# EasyEDA schematic SCH_Arduboi_2023-01-19.json
TITLE: Sheet_1; REV: 1.0; Date: 2023-01-18; Sheet: 1/1; Company: Your Company
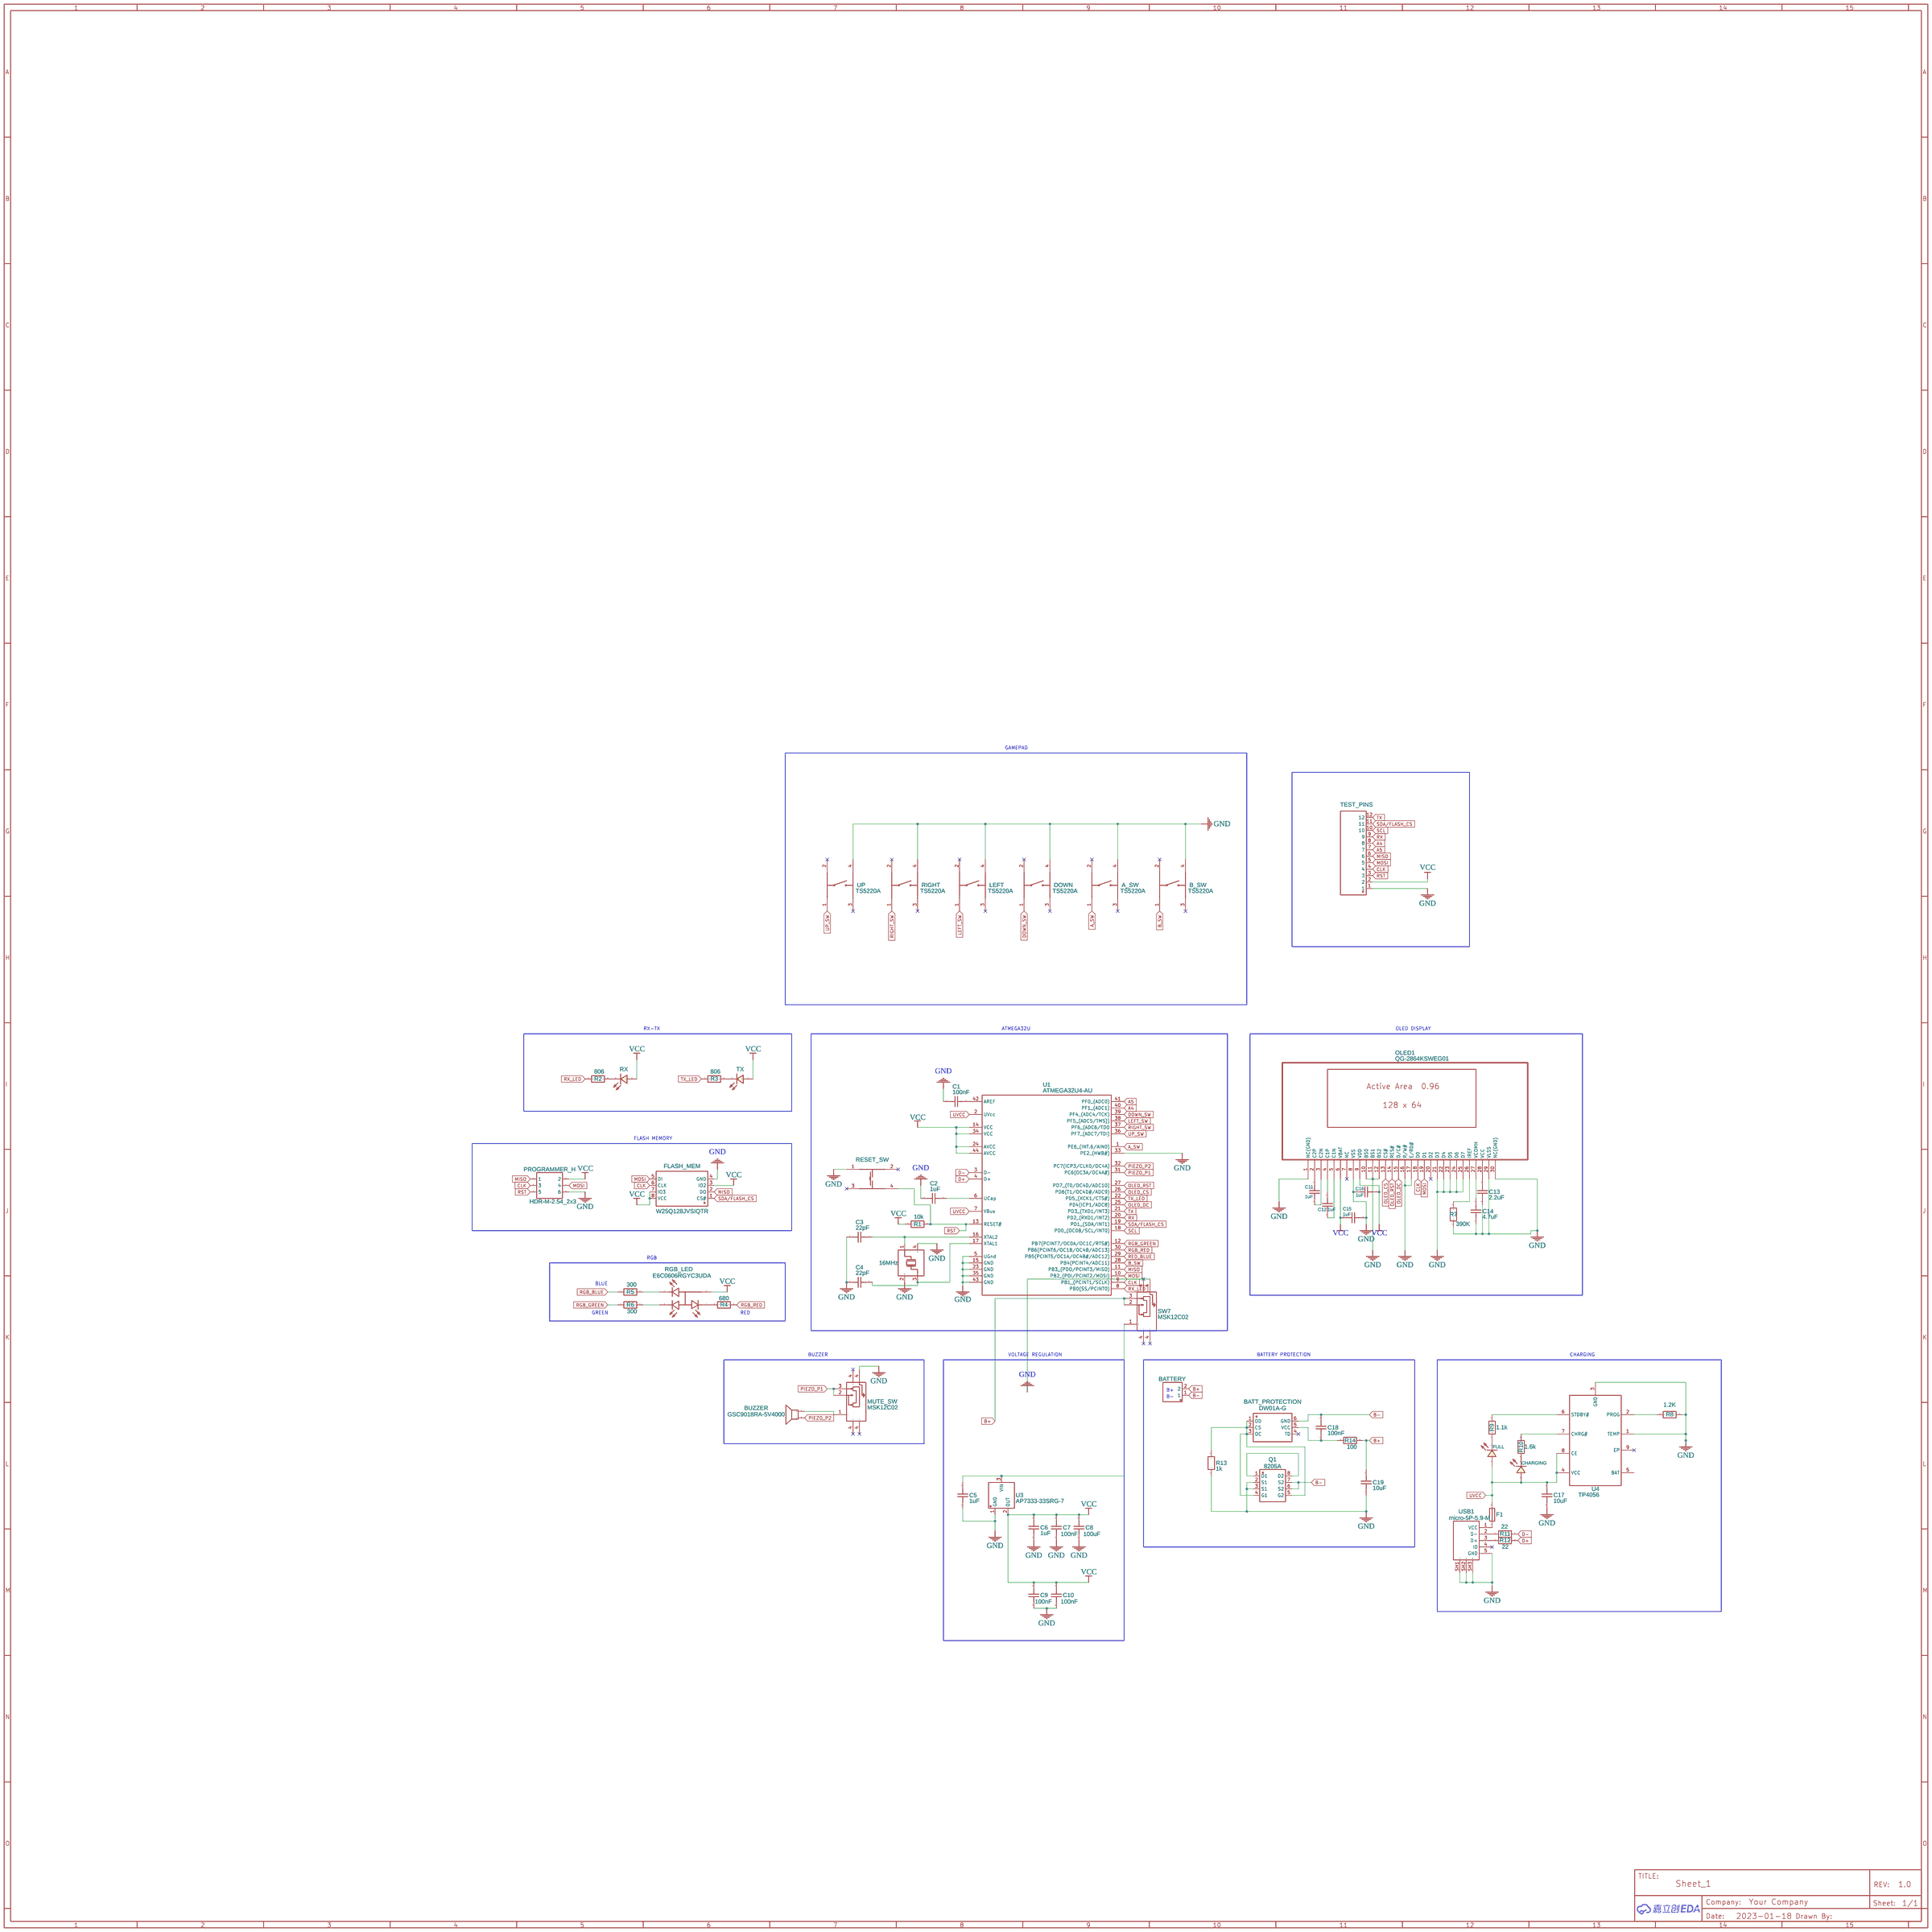
[diagram p0: schematic sheet]

## Parts
A_SW  TS5220A  [SW-SMD_4P-L5.2-W5.2-P3.70-LS6.4]
B_SW  TS5220A  [SW-SMD_4P-L5.2-W5.2-P3.70-LS6.4]
BATT_PROTECTION  DW01A-G  [SOT-23-6_L2.9-W1.6-P0.95-LS2.8-BR]
BATTERY  MTP125-1102S1  [HDR-TH_2P-P2.54-V-M-1]
BUZZER  GSC9018RA-5V4000  [BUZ-SMD_L9.0-W9.0-P8.00-LS9.3]
C1  100nF  [C0603]
C2  1uF  [C0603]
C3  22pF  [C0603]
C4  22pF  [C0603]
C5  1uF  [C0603]
C6  1uF  [C0603]
C7  100nF  [C0603]
C8  100uF  [C0603]
C9  100nF  [C0603]
C10  100nF  [C0603]
C11  1uF  [C0603]
C12  1uF  [C0603]
C13  2.2uF  [C0603]
C14  4.7uF  [C0603]
C15  1uF  [C0603]
C16  1uF  [C0603]
C17  10uF  [C0603]
C18  100nF  [C0603]
C19  10uF  [C0603]
CHARGING  LED-0603_R  [LED0603_RED]
DOWN  TS5220A  [SW-SMD_4P-L5.2-W5.2-P3.70-LS6.4]
F1  0805L110SLYR  [F0805]
FLASH_MEM  W25Q128JVSIQTR  [SOIC-8_L5.3-W5.3-P1.27-LS8.0-BL]
FULL  LED-0603_G  [LED0603_GREEN]
LEFT  TS5220A  [SW-SMD_4P-L5.2-W5.2-P3.70-LS6.4]
MUTE_SW  MSK12C02  [SW-TH_MSK12C02]
OLED1  QG-2864KSWEG01  [OLED-SMD_QG-2864KSWEG01]
PROGRAMMER_H  HDR-M-2.54_2x3  [HDR-M-2.54_2X3]
Q1  8205A  [TSSOP-8_L4.4-W3.0-P0.65-LS6.4-BL]
R1  10k  [R0603]
R2  806  [R0603]
R3  806  [R0603]
R4  680  [R0603]
R5  300  [R0603]
R6  300  [R0603]
R7  390K  [R0603]
R8  1.2K  [R0603]
R9  1.1k  [R0603]
R10  1.6k  [R0603]
R11  22  [R0603]
R12  22  [R0603]
R13  1k  [R0603]
R14  100  [R0603]
RESET_SW  K2-1808UN-A4SW-04  [KEY-SMD_4P-L4.2-W3.2-P2.20-LS4.6]
RGB_LED  E6C0606RGYC3UDA  [LED-SMD_4P-L1.6-W1.6-TL-FD]
RIGHT  TS5220A  [SW-SMD_4P-L5.2-W5.2-P3.70-LS6.4]
RX  LED-0603_B  [LED0603_BLUE]
SW7  MSK12C02  [SW-TH_MSK12C02]
TEST_PINS  A2541WR-12P  [HDR-TH_12P-P2.54-H-M-W8.6]
TX  LED-0603_B  [LED0603_BLUE]
U1  ATMEGA32U4-AU  [QFP-44_L10.0-W10.0-P0.80-LS13.2-BL]
U2  16MHz  [CRYSTAL-SMD_4P-L2.5-W2.0-BL-2]
U3  AP7333-33SRG-7  [SOT-23-3_L2.9-W1.3-P1.90-LS2.4-BR]
U4  TP4056  [ESOP-8_L4.9-W3.9-P1.27-LS6.0-BL-EP]
UP  TS5220A  [SW-SMD_4P-L5.2-W5.2-P3.70-LS6.4]
USB1  micro-5P-5.9-M  [MICRO-USB-SMD_MICRO-5P-5.9]

## Library data of the parts
A_SW B_SW DOWN LEFT RIGHT UP = TS5220A: Supplier: LCSC; Supplier Part: C412370; Manufacturer: SHOU HAN(首韩); Contributor: LCSC; JLCPCB Part Class: Extended Part
BATT_PROTECTION = DW01A-G: Supplier: LCSC; Manufacturer: FORTUNE(富晶); Contributor: LCSC; Supplier Part: C61503; JLCPCB Part Class: Extended Part
BATTERY = MTP125-1102S1: Supplier: LCSC; Supplier Part: C358684; Manufacturer: MINTRON(明硕); Contributor: LCSC; JLCPCB Part Class: Extended Part
BUZZER = GSC9018RA-5V4000: Supplier: LCSC; Supplier Part: C255319; Manufacturer: INGHAi(赢海); Contributor: LCSC; JLCPCB Part Class: Extended Part; Frequency: 4000Hz
C1-C19 = C_0603_US: Contributor: LCEDA_Lib
CHARGING = LED-0603_R: Manufacturer: EVERLIGHT(台湾亿光); Manufacturer Part: 19-217/R6C-AL1M2VY/3T; Supplier Part: C72044; Supplier: LCSC; Contributor: LCEDA_01
F1 = 0805L110SLYR: Supplier: LCSC; Supplier Part: C207024; Manufacturer: Littelfuse(美国力特); Contributor: LCSC; JLCPCB Part Class: Extended Part
FLASH_MEM = W25Q128JVSIQTR: Supplier: LCSC; Manufacturer: WINBOND(华邦); Manufacturer Part: W25Q128JVSIQ; Supplier Part: C97521; JLCPCB Part Class: Basic Part
FULL = LED-0603_G: Manufacturer: EVERLIGHT(台湾亿光); Manufacturer Part: 19-217/GHC-YR1S2/3T; Supplier Part: C72043; Supplier: LCSC; Contributor: LCEDA_Lib
MUTE_SW SW7 = MSK12C02: Supplier: LCSC; Supplier Part: C431540; Manufacturer: SHOU HAN(首韩); Contributor: LCSC; JLCPCB Part Class: Extended Part
OLED1 = QG-2864KSWEG01: Supplier: LCSC; Manufacturer: Allvision(全智景); Supplier Part: C85007
PROGRAMMER_H = HDR-M-2.54_2x3: Supplier Part: C65114; Supplier: LCSC; Contributor: LCEDA_Lib
Q1 = 8205A: Supplier: LCSC; Manufacturer: Hottech(合科泰); Contributor: LCSC; Supplier Part: C181100; JLCPCB Part Class: Extended Part
R1-R14 = R_0603_EU: Contributor: LCEDA_Lib
RESET_SW = K2-1808UN-A4SW-04: Supplier: LCSC; Manufacturer: 韩国韩荣; Contributor: LCSC; Supplier Part: C145878; JLCPCB Part Class: Extended Part
RGB_LED = E6C0606RGYC3UDA: Supplier: LCSC; Supplier Part: C5162234; Manufacturer: null; Contributor: lcsc; JLCPCB Part Class: Extended Part
RX TX = LED-0603_B: Manufacturer: EVERLIGHT(台湾亿光); Manufacturer Part: 19-217/BHC-ZL1M2RY/3T; Supplier Part: C72041; Supplier: LCSC; Contributor: LCEDA_01
TEST_PINS = A2541WR-12P: Supplier: LCSC; Supplier Part: C225498; Manufacturer: Changjiang Connectors; Contributor: LCSC; JLCPCB Part Class: Extended Part
U1 = ATMEGA32U4-AU: Supplier: LCSC; Manufacturer: MICROCHIP(美国微芯); Supplier Part: C44854; JLCPCB Part Class: Extended Part
U2 = NX2520SA-16MHZ-STD-CSW-4: Supplier: LCSC; Supplier Part: C1985890; Manufacturer: NDK; Contributor: lcsc; JLCPCB Part Class: Extended Part
U3 = AP7333-33SRG-7: Supplier: LCSC; Manufacturer: DIODES(美台); Contributor: LCSC; Supplier Part: C150745; JLCPCB Part Class: Extended Part
U4 = TP4056: Contributor: Guest; Supplier: LCSC; Manufacturer: TOPPOWER(南京拓微); Manufacturer Part: TP4056-42-ESOP8; Supplier Part: C16581; JLCPCB Part Class: Basic Part
USB1 = micro-5P-5.9-M: Supplier: LCSC; Manufacturer: 精拓金; Manufacturer Part: 920-C62A2021S10100; Supplier Part: C40939; JLCPCB Part Class: Extended Part

## Nets
GND: A_SW.4 B_SW.4 C1.1 C2.1 C3.1 C4.1 C5.1 C6.1 C7.1 C8.1 C9.1 C10.1 C13.1 C14.1 C15.2 C16.1 C17.1 C19.1 DOWN.4 FLASH_MEM.4(GND) LEFT.4 MUTE_SW.4 OLED1.1(NC(GND)) OLED1.8(VSS) OLED1.10(BS0) OLED1.11(BS1) OLED1.12(BS2) OLED1.16(R/W#) OLED1.17(E/RD#) OLED1.21(D3) OLED1.22(D4) OLED1.23(D5) OLED1.24(D6) OLED1.25(D7) OLED1.29(VLSS) OLED1.30(NC(GND)) PROGRAMMER_H.6 Q1.2(S1) Q1.3(S1) R7.1 R8.2 R13.1 RESET_SW.1 RIGHT.4 SW7.4 TEST_PINS.1 U1.5(UGnd) U1.15(GND) U1.23(GND) U1.33(PE2 (HWB#)) U1.35(GND) U1.43(GND) U2.2(GND) U2.4(GND) U3.1(GND) U4.1(TEMP) U4.3(GND) UP.4 USB1.5(GND) USB1.SH1 USB1.SH2 USB1.SH3
VCC: C6.2 C7.2 C8.2 C9.2 C10.2 C15.1 C16.2 FLASH_MEM.3(IO2) FLASH_MEM.7(IO3) FLASH_MEM.8(VCC) OLED1.6(VBAT) OLED1.9(VDD) PROGRAMMER_H.2 R1.1 RGB_LED.2(+) RX.1 TEST_PINS.2 TX.1 U1.14(VCC) U1.24(AVCC) U1.34(VCC) U1.44(AVCC) U3.2(OUT)
A4: TEST_PINS.8 U1.40(PF1 (ADC1))
A5: TEST_PINS.7 U1.41(PF0 (ADC0))
A_SW: A_SW.1 U1.1(PE6 (INT.6/AIN0))
B+: BATTERY.2 C19.2 R14.2 SW7.2 SW7.3
B-: BATT_PROTECTION.6(GND) BATTERY.1 C18.2 Q1.6(S2) Q1.7(S2)
B_SW: B_SW.1 U1.28(PB4(PCINT4/ADC11))
CLK: FLASH_MEM.6(CLK) OLED1.18(D0) PROGRAMMER_H.3 TEST_PINS.4 U1.9(PB1 (PCINT1/SCLK))
D+: R12.2 U1.4(D+)
D-: R11.2 U1.3(D-)
DOWN_SW: DOWN.1 U1.39(PF4 (ADC4/TCK))
LEFT_SW: LEFT.1 U1.38(PF5 (ADC5/TMS)))
MISO: FLASH_MEM.2(DO) PROGRAMMER_H.1 TEST_PINS.6 U1.11(PB3 (PDO/PCINT3/MISO))
MOSI: FLASH_MEM.5(DI) OLED1.19(D1) PROGRAMMER_H.4 TEST_PINS.5 U1.10(PB2 (PDI/PCINT2/MOSI))
OLED_CS: OLED1.13(CS#) U1.26(PD6(T1/OC4D#/ADC9))
OLED_DC: OLED1.15(D/C#) U1.25(PD4(ICP1/ADC8))
OLED_RST: OLED1.14(RES#) U1.27(PD7 (T0/OC4D/ADC10))
PIEZO_P1: MUTE_SW.2 MUTE_SW.3 U1.31(PC6(OC3A/OC4A#))
PIEZO_P2: BUZZER.1 U1.32(PC7(ICP3/CLK0/OC4A))
RED_BLUE: U1.29(PB5(PCINT5/OC1A/OC4B#/ADC12))
RGB_BLUE: R5.1
RGB_GREEN: R6.1 U1.12(PB7(PCINT7/OC0A/OC1C/RTS#))
RGB_RED: R4.2 U1.30(PB6(PCINT6/OC1B/OC4B/ADC13))
RIGHT_SW: RIGHT.1 U1.37(PF6 (ADC6/TDO)
RST: PROGRAMMER_H.5 R1.2 RESET_SW.4 TEST_PINS.3 U1.13(RESET#)
RX: TEST_PINS.9 U1.20(PD2 (RXD1/INT2))
RX_LED: R2.1 U1.8(PB0(SS/PCINT0))
SCL: TEST_PINS.10 U1.18(PD0 (OC0B/SCL/INT0))
SDA/FLASH_CS: FLASH_MEM.1(CS#) TEST_PINS.11 U1.19(PD1 (SDA/INT1))
TX: TEST_PINS.12 U1.21(PD3 (TXD1/INT3))
TX_LED: R3.1 U1.22(PD5 (XCK1/CTS#))
UP_SW: U1.36(PF7 (ADC7/TDI)) UP.1
UVCC: C17.2 CHARGING.1 F1.2 FULL.1 U1.2(UVcc) U1.7(VBus) U4.4(VCC) U4.8(CE)
Net-(BATT_PROTECTION-1): BATT_PROTECTION.1(OD) BATT_PROTECTION.2(CS) BATT_PROTECTION.3(OC) Q1.4(G1) Q1.5(G2) R13.2
Net-(BATT_PROTECTION-5): BATT_PROTECTION.5(VCC) C18.1 R14.1
Net-(BUZZER-2): BUZZER.2 MUTE_SW.1
Net-(C1-2): C1.2 U1.42(AREF)
Net-(C2-2): C2.2 U1.6(UCap)
Net-(C3-2): C3.2 U1.16(XTAL2) U2.1(OSC1)
Net-(C4-2): C4.2 U1.17(XTAL1) U2.3(OSC2)
Net-(C5-2): C5.2 SW7.1 U3.3(VIN)
Net-(C11-1): C11.1 OLED1.3(C2N)
Net-(C11-2): C11.2 OLED1.2(C2P)
Net-(C12-1): C12.1 OLED1.5(C1N)
Net-(C12-2): C12.2 OLED1.4(C1P)
Net-(C13-2): C13.2 OLED1.28(VCC)
Net-(C14-2): C14.2 OLED1.27(VCOMH)
Net-(CHARGING-2): CHARGING.2 R10.1
Net-(F1-1): F1.1 USB1.1(VCC)
Net-(FULL-2): FULL.2 R9.1
Net-(OLED1-26): OLED1.26(IREF) R7.2
Net-(Q1-1): Q1.1(D1) Q1.8(D2)
Net-(R2-2): R2.2 RX.2
Net-(R3-2): R3.2 TX.2
Net-(R4-1): R4.1 RGB_LED.4(-)
Net-(R5-2): R5.2 RGB_LED.1(-)
Net-(R6-2): R6.2 RGB_LED.3(-)
Net-(R8-1): R8.1 U4.2(PROG)
Net-(R9-2): R9.2 U4.6(STDBY#)
Net-(R10-2): R10.2 U4.7(CHRG#)
Net-(R11-1): R11.1 USB1.2(D-)
Net-(R12-1): R12.1 USB1.3(D+)

Not connected (* = marked no-connect by the designer): A_SW 2* 3*; B_SW 2* 3*; BATT_PROTECTION 4(TD)*; DOWN 2* 3*; LEFT 2* 3*; OLED1 7(NC)* 20(D2)*; RESET_SW 2* 3*; RIGHT 2* 3*; U4 5(BAT) 9(EP)*; UP 2* 3*; USB1 4(ID)*

## Notes on the sheet
- GAMEPAD
- RX-TX
- ATMEGA32U
- OLED DISPLAY
- FLASH MEMORY
- RGB
- BLUE
- GREEN
- RED
- BUZZER
- VOLTAGE REGULATION
- BATTERY PROTECTION
- CHARGING
- B+
- B-
